# Altium schematic sheet IMU Addition.SchDoc
size B
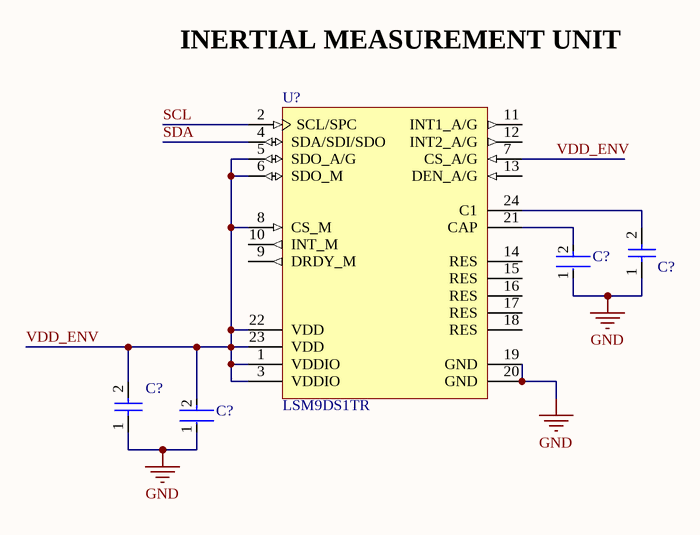
[diagram p0: IMU Addition.SchDoc]

## Parts
(Parts that share a designator on the sheet are numbered #1, #2 ... from top to bottom, then left to right.)
C?#1  GCJ188R72A103KA01D  [FP-GCJ188-0_2-IPC_A]  (value not drawn)
C?#2  VJ0603Y104KXQCW1BC  [CAPC1608X95X40ML15T15]  (value not drawn)
C?#3  GCJ188R72A103KA01D  [FP-GCJ188-0_2-IPC_A]  (value not drawn)
C?#4  VJ0603Y104KXQCW1BC  [CAPC1608X95X40ML15T15]  (value not drawn)
U?  LSM9DS1TR  [STM-LGA-24_3500X3000X1000]

## Nets
GND: C?#1.1 C?#2.1 C?#3.1 C?#4.1 U?.19(GND) U?.20(GND)
SCL: U?.2(SCL/SPC)
SDA: U?.4(SDA/SDI/SDO)
VDD_ENV: C?#3.2 C?#4.2 U?.1(VDDIO) U?.3(VDDIO) U?.5(SDO_A/G) U?.6(SDO_M) U?.7(CS_A/G) U?.8(CS_M) U?.22(VDD) U?.23(VDD)
NetC?#1_2: C?#1.2 U?.21(CAP)
NetC?#2_2: C?#2.2 U?.24(C1)

Not connected (* = marked no-connect by the designer): U? 9(DRDY_M) 10(INT_M) 11(INT1_A/G) 12(INT2_A/G) 13(DEN_A/G) 14(RES) 15(RES) 16(RES) 17(RES) 18(RES)

## Notes on the sheet
- INERTIAL MEASUREMENT UNIT

## Library data of the parts
C?#1 C?#3 = CMP-2006-02234-2: Cap Ceramic 10000pF 100V X7R 10% Pad SMD 0603 Soft Termination +125°C Automotive T/R; Capacitance: 10nF; Min Operating Temperature: -55°C; Case/Package: 0603; Case Code (Metric): 1608; Length: 0.063inch; Package Quantity: 1; Packaging: Tape and Reel; Voltage Rating: 100V; Thickness: 0.031inch; Ratings: AEC-Q200; Features: Soft Termination; Tolerance: 10%; Max Operating Temperature: 125°C; Mount: Surface Mount; Termination: SMD/SMT; Width: 0.031inch; Case Code (Imperial): 0603; Voltage Rating (DC): 100V; Lead Free: Lead Free; Depth: 0.8mm; Dielectric: X7R
C?#2 C?#4 = CMP-2006-01550-1: Manufacturer: Vitramon; Part Number: VJ0603Y104KXQCW1BC
U? = CMP-2000-06606-1: iNEMO Inertial Module: 3D Accelerometer, 3D Gyroscope, 3D Magnetometer, 1.9 to 3.6 V, -40 to 85 degC, 24-Pin LGA, RoHS, Tape and Reel; Manufacturer: STMicroelectronics; SVHC: NoSVHC(17-Dec-2015); MEMS Module Function: Tri-AxisGyroscope,Tri-AxisAccelerometer,Tri-AxisMagnetometer; Supply Voltage Max: 3.6V; No. of Pins: 24Pins; Gyroscope Range: ±245°/s,±500°/s,±2000°/s; Acceleration Range: ±2g,±4g,±8g,±16g; Supply Voltage Min: 1.9V; Package Description: 24-Pin Plastic Land Grid Array Package, Body 3.65 x 3.15 mm, Pitch 0.43 mm; Manufacturer URL: http://www.st.com/; PartNumber: LSM9DS1; Product Range: -; Packaging: CutTape; Sensor Case Style: LGA; Datasheet URL: http://www2.st.com/content/ccc/resource/technical/document/datasheet/1e/3f/2a/d6/25/eb/48/46/DM00103319.pdf/files/DM00103319.pdf/jcr:content/translations/en.DM00103319.pdf; Package Reference: LGA-24_3500X3000X1000; Mounting Technology: SurfaceMount; Datasheet Version: Rev. 3, 03/2015; MSL: MSL3-168hours